# EAGLE design svf (EAGLE 7.5.0)
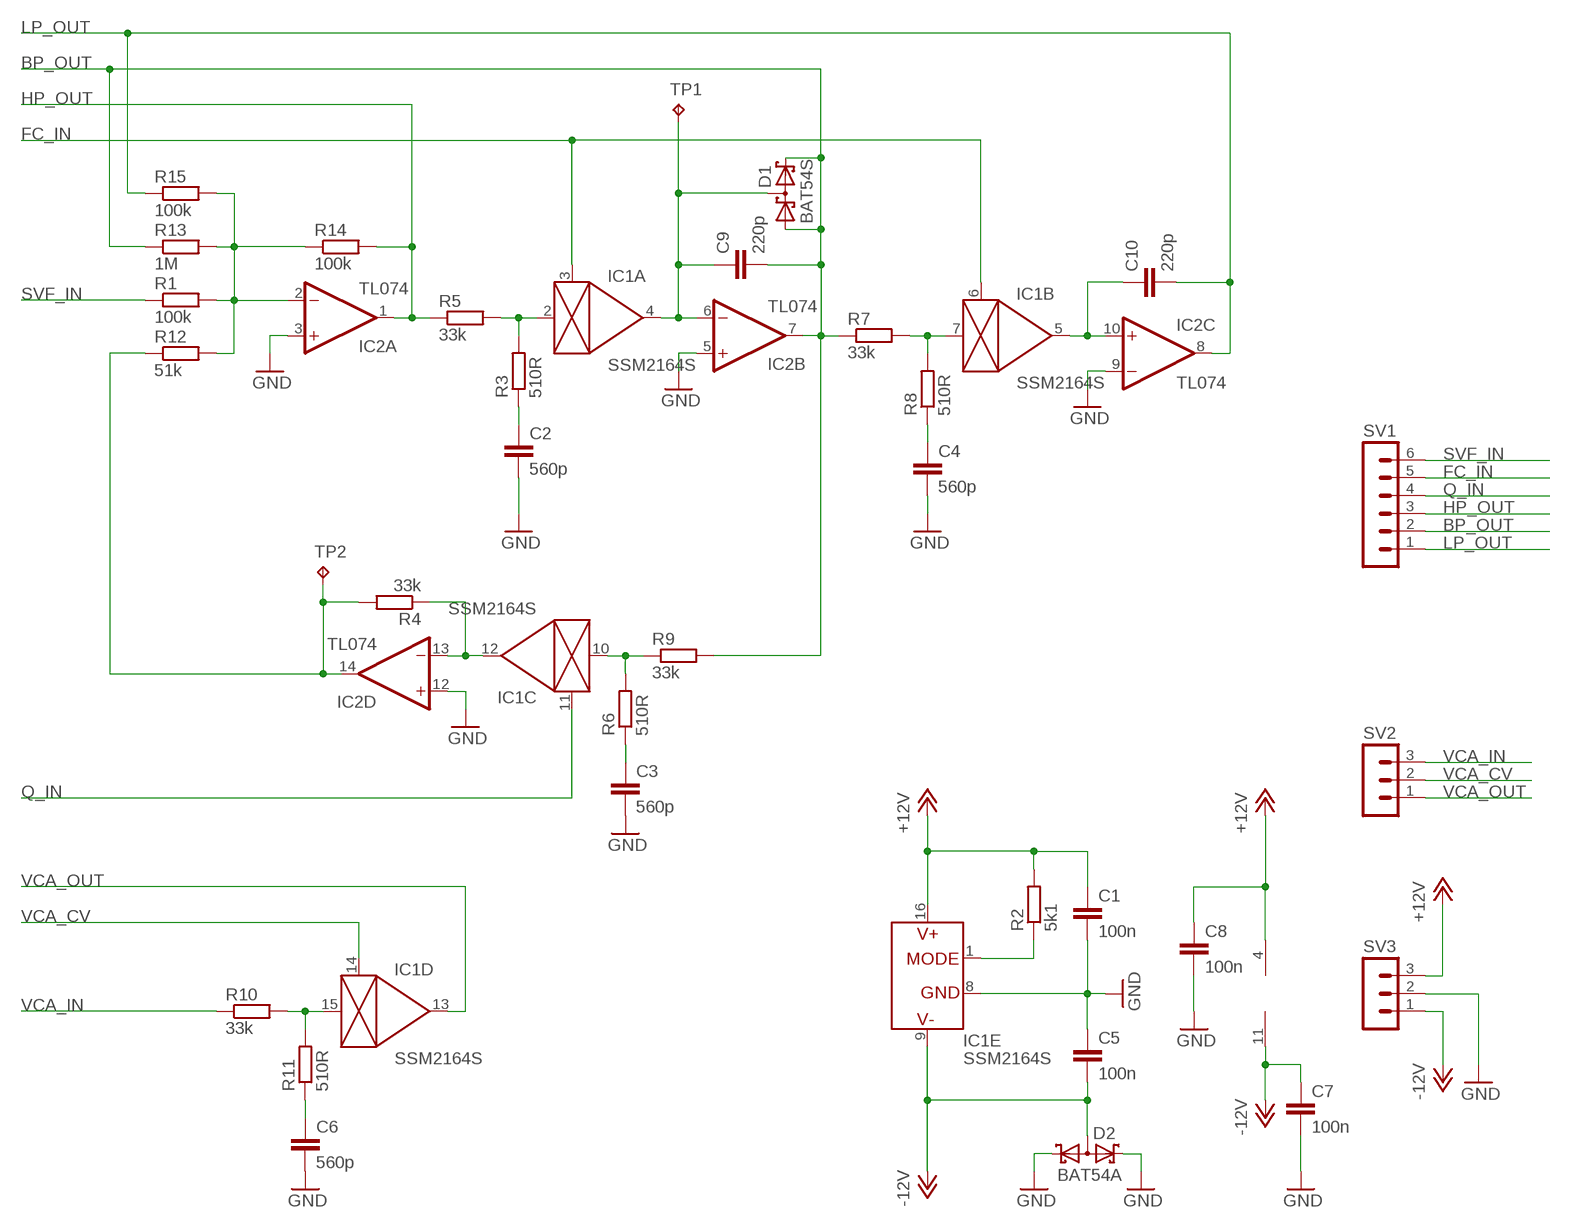
[diagram p0: schematic, sheet 1]

## Parts
C1  100n  C-EUC0603  [C0603]
C2  560p  C-EUC0603  [C0603]
C3  560p  C-EUC0603  [C0603]
C4  560p  C-EUC0603  [C0603]
C5  100n  C-EUC0603  [C0603]
C6  560p  C-EUC0603  [C0603]
C7  100n  C-EUC0603  [C0603]
C8  100n  C-EUC0603  [C0603]
C9  220p  C-EUC0603  [C0603]
C10  220p  C-EUC0603  [C0603]
D1  BAT54S  [SOT23]
D2  BAT54A  [SOT23]
IC1  SSM2164S  [SOIC16N]
IC2  TL074  TL074D  [SO14]
R1  100k  R-EU_0603  [0603]
R2  5k1  R-EU_0603  [0603]
R3  510R  R-EU_0603  [0603]
R4  33k  R-EU_0603  [0603]
R5  33k  R-EU_0603  [0603]
R6  510R  R-EU_0603  [0603]
R7  33k  R-EU_0603  [0603]
R8  510R  R-EU_0603  [0603]
R9  33k  R-EU_0603  [0603]
R10  33k  R-EU_0603  [0603]
R11  510R  R-EU_0603  [0603]
R12  51k  R-EU_0603  [0603]
R13  1M  R-EU_0603  [0603]
R14  100k  R-EU_0603  [0603]
R15  100k  R-EU_0603  [0603]
SV1  MA06-1  [MA06-1]
SV2  MA03-1  [MA03-1]
SV3  MA03-1  [MA03-1]
TP1  TPPAD1-13  [P1-13]
TP2  TPPAD1-13  [P1-13]

## Nets
+12V: C1.1 C8.1 IC1.16(E:V+) IC2.4(P:V+) R2.2 SV3.3
-12V: C5.2 C7.1 D2.3(AA) IC1.9(E:V-) IC2.11(P:V-) SV3.1
BP_OUT: C9.2 D1.1(A1) D1.2(C2) IC2.7(B:OUT) R7.1 R9.2 R13.1 SV1.2
FB_IN: IC2.14(D:OUT) R4.2 R12.1 TP2.TP
FC_IN: IC1.3(A:CTRL) IC1.6(B:CTRL) SV1.5
GND: C1.2 C2.2 C3.2 C4.2 C5.1 C6.2 C7.2 C8.2 D2.1(K1) D2.2(K2) IC1.8(E:GND) IC2.3(A:+IN) IC2.5(B:+IN) IC2.9(C:-IN) IC2.12(D:+IN) SV3.2
HP_OUT: IC2.1(A:OUT) R5.1 R14.2 SV1.3
LP_OUT: C10.2 IC2.8(C:OUT) R15.1 SV1.1
N$1: IC1.1(E:MODE) R2.1
N$2: IC1.7(B:IN) R7.2 R8.2
N$4: C4.1 R8.1
N$5: C10.1 IC1.5(B:OUT) IC2.10(C:+IN)
N$8: IC1.12(C:OUT) IC2.13(D:-IN) R4.1
N$12: IC2.2(A:-IN) R1.2 R12.2 R13.2 R14.1 R15.2
N$17: C6.1 R11.1
N$19: C9.1 D1.3(C1A2) IC1.4(A:OUT) IC2.6(B:-IN) TP1.TP
N$21: IC1.10(C:IN) R6.2 R9.1
N$26: IC1.15(D:IN) R10.2 R11.2
N$27: C3.1 R6.1
N$29: IC1.2(A:IN) R3.2 R5.2
N$30: C2.1 R3.1
Q_IN: IC1.11(C:CTRL) SV1.4
SVF_IN: R1.1 SV1.6
VCA_CV: IC1.14(D:CTRL) SV2.2
VCA_IN: R10.1 SV2.3
VCA_OUT: IC1.13(D:OUT) SV2.1

## Library data of the parts
C1-C10 = Rebel:C-EU: CAPACITOR, European symbol
D1 = diode:BAT54S: Schottky Diodes Pin connection corrected 2011-05-04 Source: Fairchild .. BAT54.pdf
D2 = diode:BAT54A: Schottky Diodes Source: Fairchild .. BAT54.pdf
IC1 = ssm2164:SSM2164
IC2 = linear:TL074: OP AMP
R1-R15 = Rebel:R-EU_: RESISTOR, European symbol
SV1 = con-lstb:MA06-1: PIN HEADER; OC_FARNELL: unknown; OC_NEWARK: unknown
SV2 SV3 = con-lstb:MA03-1: PIN HEADER; OC_FARNELL: unknown; OC_NEWARK: unknown
TP1 TP2 = testpad:TP: Test pad

## Board
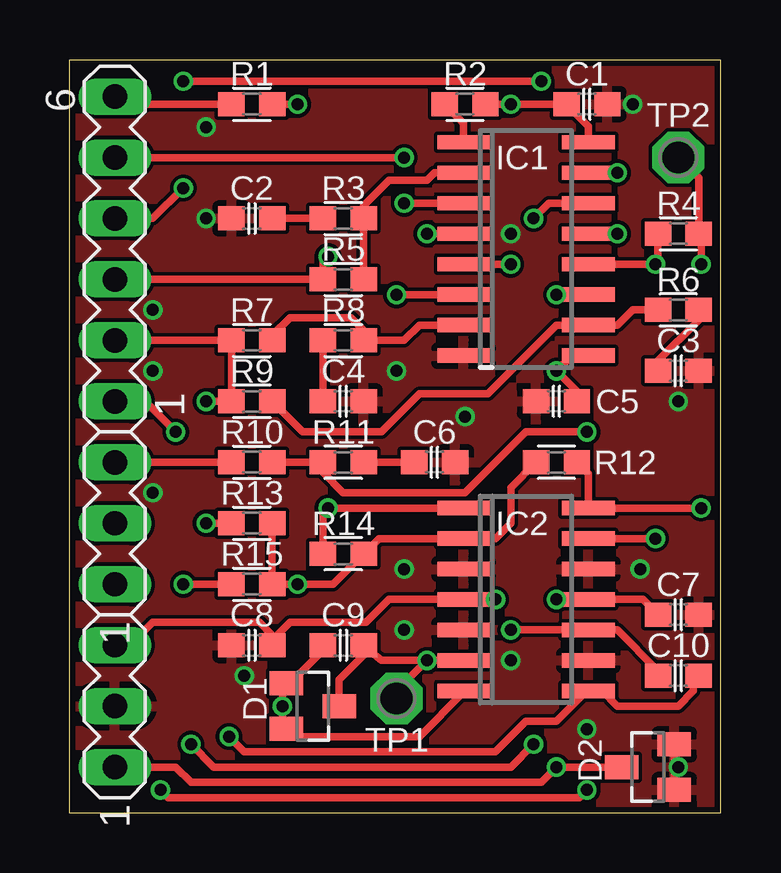
[diagram p1: board, top side]
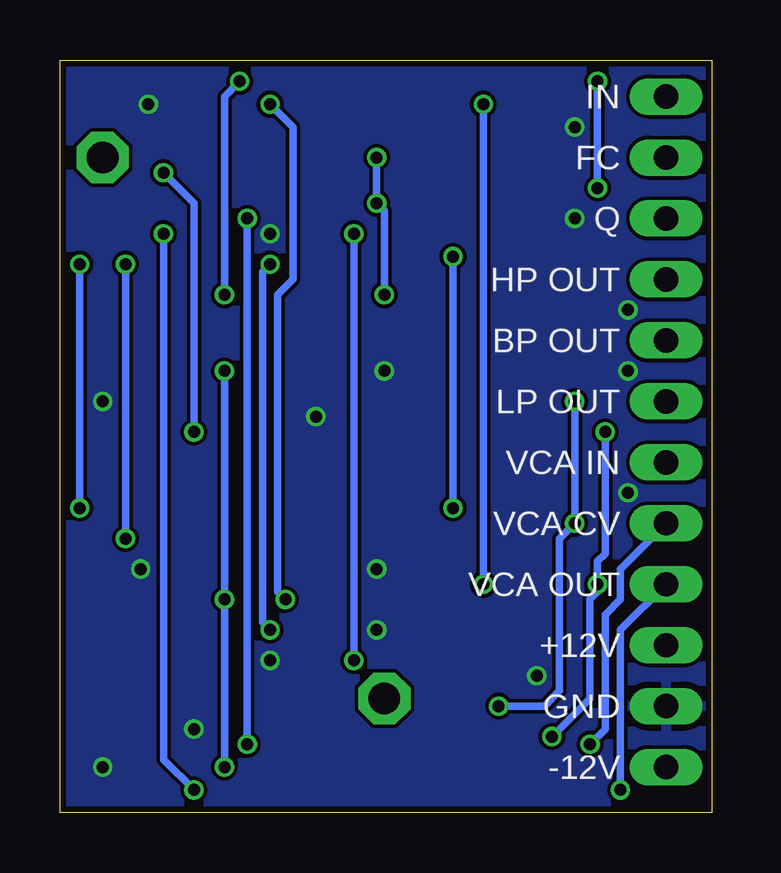
[diagram p2: board, bottom side, seen from below]

Size 27.18 x 31.37 mm. Coordinates in mm from the lower left corner, seen from the top.
Outline: 0,0 27.18,0 27.18,31.37 0,31.37 0,0
Copper layers (1*16): Top 0.035mm / dielectric 1.5mm / Bottom 0.035mm
Design rules "SeeedStudio_2layer_DRU_no_angle_20140221": minimum track width 6mil, minimum drill 12mil, track to track 6mil, track to pad 6mil, pad to pad 6mil, via to via 6mil, smd to smd 0mil, copper to edge 10mil, drill to drill 10mil, minimum pad ring 10mil, minimum via ring 6mil, stop-mask expansion 2mil, vias tented up to drill 100mil, thermal gap 10mil

### Footprints (pad centres in the part's own frame; a part is rotated, then mirrored left to right if it is on the bottom)
C0603 = smd 1.1 x 1: 1 -0.85,0; 2 0.85,0
SOT23 = smd 1 x 1.4: 1 -0.95,-1.1; 2 0.95,-1.1; 3 0,1.1
SOIC16N = smd 0.6 x 2.2: 1 -4.445,-2.6; 2 -3.175,-2.6; 3 -1.905,-2.6; 4 -0.635,-2.6; 5 0.635,-2.6; 6 1.905,-2.6; 7 3.175,-2.6; 8 4.445,-2.6; 9 4.445,2.6; 10 3.175,2.6; 11 1.905,2.6; 12 0.635,2.6; 13 -0.635,2.6; 14 -1.905,2.6; 15 -3.175,2.6; 16 -4.445,2.6
SO14 = smd 0.6 x 2.2: 1 -3.81,-2.6; 2 -2.54,-2.6; 3 -1.27,-2.6; 4 0,-2.6; 5 1.27,-2.6; 6 2.54,-2.6; 7 3.81,-2.6; 8 3.81,2.6; 9 2.54,2.6; 10 1.27,2.6; 11 0,2.6; 12 -1.27,2.6; 13 -2.54,2.6; 14 -3.81,2.6
0603 = smd 1.1 x 1: 1 -0.85,0; 2 0.85,0
MA06-1 = drill 1.016 long: 1 -6.35,0; 2 -3.81,0; 3 -1.27,0; 4 1.27,0; 5 3.81,0; 6 6.35,0
MA03-1 = drill 1.016 long: 1 -2.54,0; 2 0,0; 3 2.54,0
P1-13 = drill 1.321 pad 2.159 octagon: TP 0,0

### Placement (x,y rotation side)
C1  21.59,29.53 0 top
C2  7.62,24.76 180 top
C3  25.4,18.41 0 top
C4  11.43,17.14 0 top
C5  20.32,17.14 0 top
C6  15.24,14.61 0 top
C7  25.4,8.26 0 top
C8  7.62,6.99 180 top
C9  11.43,6.99 180 top
C10  25.4,5.71 0 top
D1  10.16,4.45 270 top
D2  24.13,1.91 90 top
IC1  19.05,23.49 270 top
IC2  19.05,8.89 270 top
R1  7.62,29.53 0 top
R2  16.51,29.53 0 top
R3  11.43,24.76 0 top
R4  25.4,24.13 0 top
R5  11.43,22.22 0 top
R6  25.4,20.95 180 top
R7  7.62,19.68 0 top
R8  11.43,19.68 0 top
R9  7.62,17.14 180 top
R10  7.62,14.61 0 top
R11  11.43,14.61 180 top
R12  20.32,14.61 180 top
R13  7.62,12.06 0 top
R14  11.43,10.79 180 top
R15  7.62,9.53 0 top
SV1  1.91,23.49 90 top
SV2  1.91,12.06 90 top
SV3  1.91,4.45 90 top
TP1  13.65,4.76 0 top
TP2  25.4,27.3 0 top

### Tracks (layer width: path | path; a pad name or v marks a point on that pad's centre or on a via)
+12V  (via drill 0.5)
  Top 0.305: R2.2 v18.41,29.53 C1.1 21.65,28.62 IC1.16 | v17.78,8.89 IC2.4 13.34,8.89 12.38,7.94 9.21,7.94 8.47,7.2 C8.1 8.47,7.4 7.94,7.94 3.49,7.94 2.54,6.99 SV3.3
  Bottom 0.305: v17.78,8.89 18.1,9.21 18.1,21.59 17.46,22.22 17.46,28.57 v18.41,29.53
-12V  (via drill 0.5)
  Top 0.305: C7.1 23.91,8.89 IC2.11 v20.32,8.89 | IC1.9 20.95,19.05 v20.32,18.41 21.17,17.56 C5.2 | D2.3 v20.32,1.91 19.68,1.27 5.08,1.27 4.45,1.91 SV3.1
  Bottom 0.305: v20.32,1.91 v20.32,8.89 v20.32,18.41
BP_OUT  (via drill 0.5)
  Top 0.305: SV1.2 R7.1 R9.2 v5.71,17.14 | R13.1 v5.71,12.06 | 10.48,6.99 C9.2 10.58,6.77 9.21,5.4 D1.1 8.89,5.23 v8.89,4.45 8.89,3.67 D1.2 8.74,3.17 14.61,3.17 16.45,5.02 IC2.7
  Bottom 0.305: v5.71,17.14 v5.71,12.06 6.35,11.43 6.35,5.08 6.99,4.45 v8.89,4.45
FB_IN  (via drill 0.5)
  Top 0.305: v26.35,12.7 IC2.14 21.65,14.12 R12.1 | v26.35,22.86 26.35,24.03 R4.2 26.25,26.45 TP2.TP
  Bottom 0.305: v26.35,22.86 v26.35,12.7
FC_IN  (via drill 0.5)
  Top 0.305: SV1.5 v13.97,27.3 | v13.65,21.59 IC1.6 | IC1.3 v13.97,25.4
  Bottom 0.305: v13.97,27.3 v13.97,25.4 13.65,25.08 v13.65,21.59
GND  (via drill 0.5)
  Top 0.305: D2.1 25.23,1.74 v25.4,1.91 25.23,2.08 D2.2
  other vias: 16.51,16.51 13.65,18.41 13.97,7.62 18.41,6.35 23.5,29.53 5.71,24.76 13.97,10.16 7.3,5.71 3.49,20.95 5.71,28.57 25.4,17.14 23.81,10.16 3.49,13.34 3.49,18.41 21.59,3.49 18.41,24.13
  pour Bottom: -1.27,32.07 29.21,32.07 29.21,-3.17 -1.27,-3.17
  pour Top: -2.54,33.34 30.48,33.34 30.48,-3.17 -2.54,-3.17
HP_OUT  (via drill 0.5)
  Top 0.305: SV1.3 R5.1 10.58,22.96 v10.79,23.18 | IC2.1 v10.79,12.7 10.58,12.48 R14.2
  Bottom 0.305: v10.79,12.7 v10.79,23.18
LP_OUT  (via drill 0.5)
  Top 0.305: R15.1 v4.76,9.53 | C10.2 26.04,5.5 26.04,5.08 25.4,4.45 22.86,4.45 22.23,5.08 IC2.8 21.59,5.08 20.32,3.81 19.05,3.81 17.78,2.54 7.3,2.54 v6.67,3.17 | v4.45,15.88 3.17,17.14 SV1.1
  Bottom 0.305: v6.67,3.17 5.08,4.76 5.08,8.89 4.76,9.21 v4.76,9.53 4.76,10.48 4.45,10.79 v4.45,15.88
N$1
  Top 0.305: IC1.1 16.45,28.74 R2.1
N$2
  Top 0.305: R7.2 8.47,19.9 9.21,20.64 11.75,20.64 12.28,20.1 R8.2 13.97,19.68 14.61,20.32 IC1.7
N$4
  Top 0.305: R8.1 C4.1
N$5  (via drill 0.5)
  Top 0.305: C10.1 24.55,5.93 22.86,7.62 IC2.10 v18.41,7.62 | v18.41,22.86 IC1.5
  Bottom 0.305: v18.41,7.62 18.73,7.94 18.73,22.54 v18.41,22.86
N$8  (via drill 0.5)
  Top 0.305: IC1.12 v24.45,22.86 | v24.45,22.86 23.91,22.86 | IC2.13 v24.45,11.43 | R4.1 24.55,22.96 v24.45,22.86
  Bottom 0.305: v24.45,11.43 v24.45,22.86
N$12  (via drill 0.5)
  Top 0.305: R1.2 v9.53,29.53 | R13.2 R15.2 v9.53,9.53 11.01,9.53 R14.1 12.91,11.43 IC2.2 17.78,11.43 18.41,12.06 18.41,13.55 R12.2
  Bottom 0.305: v9.53,29.53 v9.53,9.53
N$17
  Top 0.305: R11.1 C6.1
N$19  (via drill 0.5)
  Top 0.305: IC1.4 v14.92,24.13 | v14.92,6.35 IC2.6 | v14.92,6.35 13.02,6.35 12.84,6.51 C9.1 12.28,6.57 11.26,5.54 D1.3 | TP1.TP 13.65,5.08 v14.92,6.35
  Bottom 0.305: v14.92,24.13 v14.92,6.35
N$21
  Top 0.305: R6.2 23.5,20.95 22.86,20.32 IC1.10 20.32,20.32 17.46,17.46 14.61,17.46 13.02,15.88 9.74,15.88 R9.1
N$26  (via drill 0.5)
  Top 0.305: R10.2 R11.2 10.58,14.19 11.43,13.34 16.51,13.34 19.05,15.88 v21.59,15.88 | v22.86,26.67 IC1.15
  Bottom 0.305: v21.59,15.88 21.59,25.4 v22.86,26.67
N$27
  Top 0.305: R6.1 26.25,20.54 24.55,18.83 C3.1
N$29
  Top 0.305: R5.2 R3.2 12.28,25.3 13.34,26.35 14.92,26.35 15.24,26.67 IC1.2
N$30
  Top 0.305: R3.1 C2.1
Q_IN  (via drill 0.5)
  Top 0.305: SV1.4 3.49,24.76 v4.76,26.04 | IC1.11 v20.32,21.59 | v19.68,30.48 v4.76,30.48
  Bottom 0.305: v20.32,21.59 20.32,29.84 v19.68,30.48 | v4.76,30.48 v4.76,26.04
SVF_IN
  Top 0.305: SV1.6 2.54,29.84 2.86,29.53 R1.1
VCA_CV  (via drill 0.5)
  Top 0.305: v5.08,2.86 6.03,1.91 18.41,1.91 v19.37,2.86 | v19.37,24.76 20,25.4 IC1.14
  Bottom 0.305: SV2.2 3.81,10.16 3.81,8.89 4.45,8.26 4.45,3.49 v5.08,2.86 | v19.37,2.86 v19.37,24.76
VCA_IN
  Top 0.305: SV2.3 R10.1
VCA_OUT  (via drill 0.5)
  Top 0.305: v3.81,0.95 4.13,0.64 21.27,0.64 v21.59,0.95 | v22.86,24.13 IC1.13
  Bottom 0.305: SV2.1 3.81,7.62 v3.81,0.95 | v21.59,0.95 22.86,2.22 v22.86,24.13

### Text on the board
bPlace: IN | FC | Q | HP OUT | BP OUT | LP OUT | VCA IN | VCA CV | VCA OUT | +12V | GND | -12V